# EAGLE design Puncher (EAGLE 7.7.0)
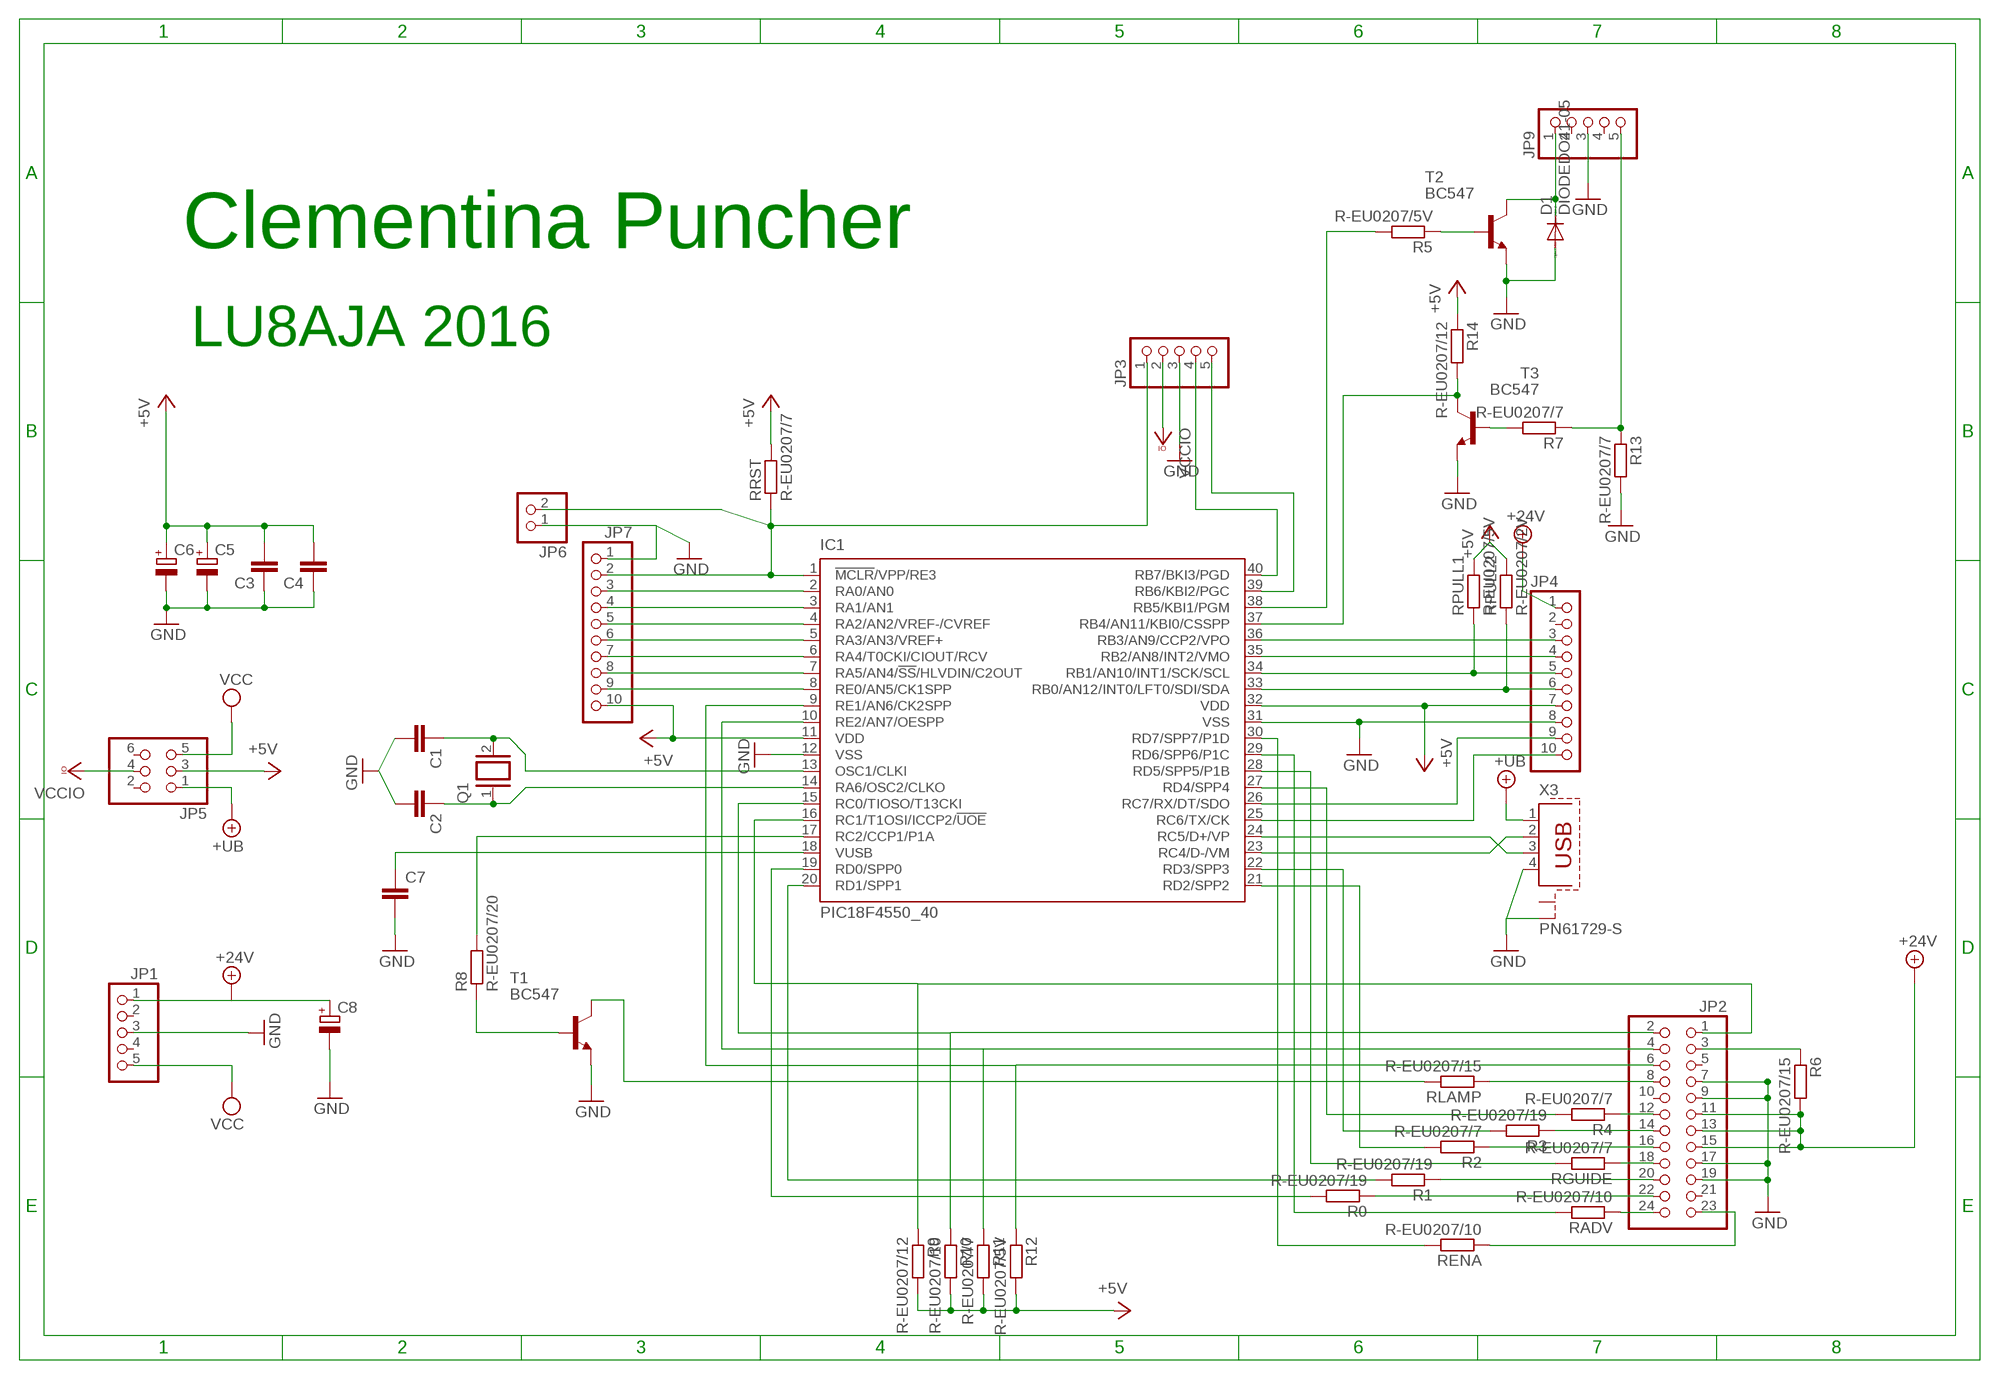
[diagram p0: schematic, sheet 1]

## Parts
C1  C-EU025-025X050  [C025-025X050]
C2  C-EU025-025X050  [C025-025X050]
C3  C-EU050-025X075  [C050-025X075]
C4  C-EU025-030X050  [C025-030X050]
C5  CPOL-EUE5-8.5  [E5-8,5]
C6  CPOL-EUE5-8.5  [E5-8,5]
C7  C-EU050-025X075  [C050-025X075]
C8  CPOL-EUE5-8.5  [E5-8,5]
D1  DIODEDO41-05  [DO41-05]
IC1  PIC18F4550_40  [DIL40]
JP1  PINHD-1X5  [1X05]
JP2  PINHD-2X12  [2X12]
JP3  PINHD-1X5  [1X05]
JP4  PINHD-1X10  [1X10]
JP5  PINHD-2X3  [2X03]
JP6  PINHD-1X2  [1X02]
JP7  PINHD-1X10  [1X10]
JP9  PINHD-1X5  [1X05]
Q1  XTAL/S  [QS]
R0  R-EU0207/19  [0207/19]
R1  R-EU0207/19  [0207/19]
R2  R-EU0207/7  [0207/7]
R3  R-EU0207/19  [0207/19]
R4  R-EU0207/7  [0207/7]
R5  R-EU0207/5V  [0207/5V]
R6  R-EU0207/15  [0207/15]
R7  R-EU0207/7  [0207/7]
R8  R-EU0207/20  [0207/20]
R9  R-EU0207/12  [0207/12]
R10  R-EU0207/10  [0207/10]
R11  R-EU0207/7  [0207/7]
R12  R-EU0207/5V  [0207/5V]
R13  R-EU0207/7  [0207/7]
R14  R-EU0207/12  [0207/12]
RADV  R-EU0207/10  [0207/10]
RENA  R-EU0207/10  [0207/10]
RGUIDE  R-EU0207/7  [0207/7]
RLAMP  R-EU0207/15  [0207/15]
RPULL1  R-EU0207/5V  [0207/5V]
RPULL2  R-EU0207/2V  [0207/2V]
RRST  R-EU0207/7  [0207/7]
T1  BC547  [TO92]
T2  BC547  [TO92]
T3  BC547  [TO92]
X3  PN61729-S  [PN61729-S]

## Nets
+5V: C3.2 C4.2 C5.+ C6.+ IC1.11(VDD) IC1.32(VDD) JP4.7 JP5.3 JP7.10 R9.2 R10.2 R11.2 R12.2 R14.1 RPULL1.2 RPULL2.2 RRST.2
+24V: C8.+ JP1.1 JP2.11 JP2.13 JP2.15 JP4.1 R6.2
+UB: JP5.1 X3.1
GND: C1.2 C2.2 C3.1 C4.1 C5.- C6.- C7.2 C8.- D1.A IC1.12(VSS) IC1.31(VSS) JP1.3 JP2.7 JP2.9 JP2.17 JP2.19 JP3.3 JP4.8 JP6.1 JP7.1 JP9.3 R13.2 T1.1(E) T2.1(E) T3.1(E) X3.4 X3.S2
N$1: JP2.24 RADV.1
N$2: C2.1 IC1.14(RA6/OSC2/CLKO) Q1.1
N$3: IC1.1(!MCLR!/VPP/RE3) JP3.1 JP6.2 JP7.2 RRST.1
N$4: IC1.17(RC2/CCP1/P1A) R8.2
N$5: IC1.16(RC1/T1OSI/ICCP2/!UOE) JP2.1 R9.1
N$6: IC1.15(RC0/TIOSO/T13CKI) JP2.2 R10.1
N$7: IC1.10(RE2/AN7/OESPP) JP2.4 R11.1
N$8: IC1.9(RE1/AN6/CK2SPP) JP2.6 R12.1
N$9: IC1.8(RE0/AN5/CK1SPP) JP7.9
N$10: IC1.7(RA5/AN4/!SS!/HLVDIN/C2OUT) JP7.8
N$11: IC1.6(RA4/T0CKI/CIOUT/RCV) JP7.7
N$12: C1.1 IC1.13(OSC1/CLKI) Q1.2
N$13: IC1.5(RA3/AN3/VREF+) JP7.6
N$14: IC1.4(RA2/AN2/VREF-/CVREF) JP7.5
N$15: C7.1 IC1.18(VUSB)
N$16: JP2.22 R0.1
N$17: IC1.22(RD3/SPP3) R3.2
N$18: JP2.20 R1.1
N$19: JP2.18 RGUIDE.1
N$20: JP2.16 R2.1
N$21: JP2.14 R3.1
N$22: JP2.12 R4.1
N$23: JP2.23 RENA.1
N$24: IC1.30(RD7/SPP7/P1D) RENA.2
N$25: IC1.29(RD6/SPP6/P1C) RADV.2
N$26: IC1.28(RD5/SPP5/P1B) RGUIDE.2
N$27: IC1.24(RC5/D+/VP) X3.3
N$28: IC1.3(RA1/AN1) JP7.4
N$30: IC1.36(RB3/AN9/CCP2/VPO) JP4.3
N$31: IC1.33(RB0/AN12/INT0/LFT0/SDI/SDA) JP4.6 RPULL2.1
N$32: IC1.27(RD4/SPP4) R4.2
N$33: IC1.21(RD2/SPP2) R2.2
N$34: IC1.23(RC4/D-/VM) X3.2
N$35: IC1.20(RD1/SPP1) R1.2
N$36: IC1.19(RD0/SPP0) R0.2
N$37: IC1.25(RC6/TX/CK) JP4.10
N$38: IC1.26(RC7/RX/DT/SDO) JP4.9
N$39: IC1.34(RB1/AN10/INT1/SCK/SCL) JP4.5 RPULL1.1
N$40: IC1.35(RB2/AN8/INT2/VMO) JP4.4
N$41: JP2.8 RLAMP.1
N$42: JP2.3 R6.1
N$43: RLAMP.2 T1.3(C)
N$44: R8.1 T1.2(B)
N$45: IC1.2(RA0/AN0) JP7.3
N$46: IC1.38(RB5/KBI1/PGM) R5.2
N$47: IC1.37(RB4/AN11/KBI0/CSSPP) R14.2 T3.3(C)
N$49: R5.1 T2.2(B)
N$50: D1.C JP9.1 T2.3(C)
N$53: IC1.39(RB6/KBI2/PGC) JP3.5
N$54: IC1.40(RB7/BKI3/PGD) JP3.4
N$55: R7.2 T3.2(B)
N$56: JP9.5 R7.1 R13.1
VCC: JP1.5 JP5.5
VCCIO: JP3.2 JP5.4
Unconnected: JP1.2 JP1.4 JP2.5 JP2.10 JP2.21 JP4.2 JP5.2 JP5.6 JP9.2 JP9.4 X3.S1

## Notes on the sheet
- Clementina Puncher
- LU8AJA 2016

## Library data of the parts
C1-C3 = rcl:C-EU: CAPACITOR, European symbol
C4 C7 = custom:C-EU: CAPACITOR, European symbol
C5 C6 = rcl:CPOL-EU: POLARIZED CAPACITOR, European symbol
C8 = custom:CPOL-EU: POLARIZED CAPACITOR, European symbol
D1 = custom:DIODE: DIODE general purpose rectifier, 1 A
IC1 = microchip:PIC18F4*_40: USB Microcontrollers with nanoWatt Technology High-Performance, Enhanced Flash, 28/40/44-Pin, Source: http://ww1.microchip.com/downloads/en/devicedoc/39632c.pdf; MF: MICROCHIP; MPN: PIC18F4550-I/P; OC_FARNELL: 9321357; OC_NEWARK: 74K8623
JP1 JP3 JP9 = pinhead:PINHD-1X5: PIN HEADER
JP2 = pinhead:PINHD-2X12: PIN HEADER
JP4 JP7 = pinhead:PINHD-1X10: PIN HEADER
JP5 = pinhead:PINHD-2X3: PIN HEADER
JP6 = pinhead:PINHD-1X2: PIN HEADER
Q1 = special:XTAL/S: CRYSTAL
R0 R1-R14 RADV RENA RGUIDE RLAMP RPULL1 RPULL2 RRST = custom:R-EU: RESISTOR, European symbol
T1-T3 = transistor:BC547: NPN TRANSISTOR
X3 = con-berg:PN61729-S: BERG USB connector; OC_FARNELL: unknown; OC_NEWARK: unknown

## Board
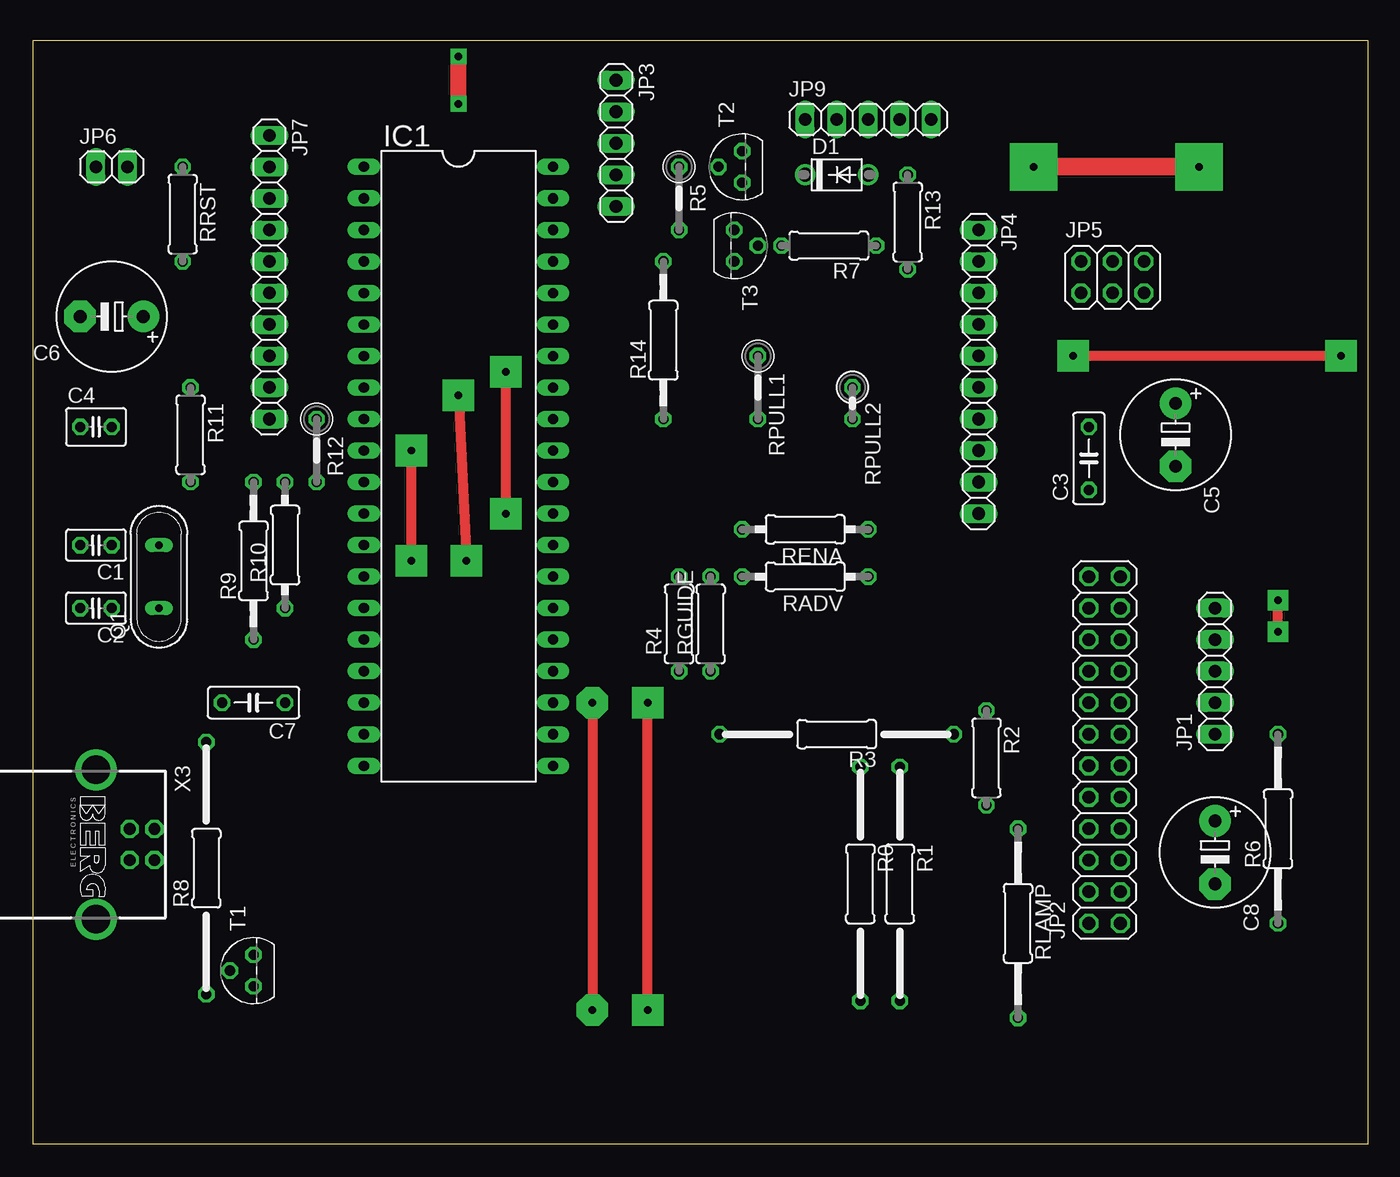
[diagram p1: board, top side]
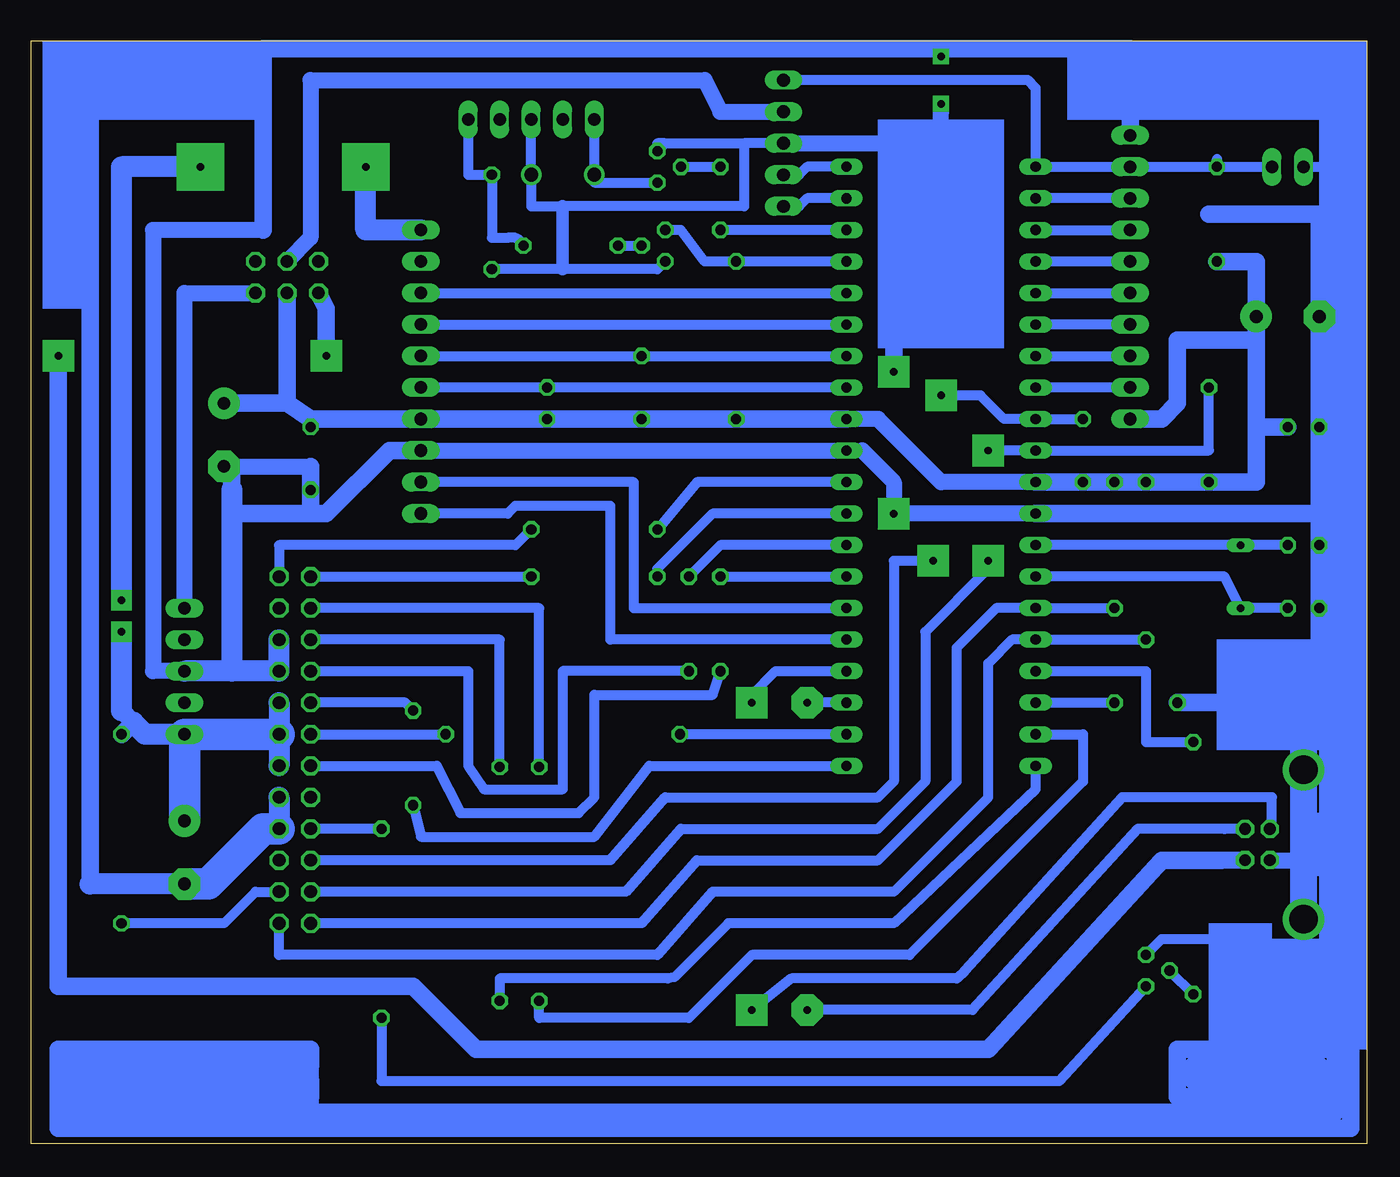
[diagram p2: board, bottom side, seen from below]

Size 107.62 x 88.89 mm. Coordinates in mm from the lower left corner, seen from the top.
Outline: 0,0 107.62,0 107.62,88.89 0,88.89 0,0
Copper layers (1*16): Top 0.035mm / dielectric 1.5mm / Bottom 0.035mm
Design rules "default": minimum track width 10mil, minimum drill 24mil, track to track 8mil, track to pad 8mil, pad to pad 8mil, via to via 8mil, smd to smd 8mil, copper to edge 40mil, drill to drill 8mil, minimum pad ring 10mil, minimum via ring 8mil, stop-mask expansion 4mil, vias tented up to drill 0mil, thermal gap 10mil

### Footprints (pad centres in the part's own frame; a part is rotated, then mirrored left to right if it is on the bottom)
C025-025X050 = drill 0.813 octagon: 1 -1.27,0; 2 1.27,0
C050-025X075 = drill 0.813 octagon: 1 -2.54,0; 2 2.54,0
C025-030X050 = drill 0.813 octagon: 1 -1.27,0; 2 1.27,0
E5-8,5 = drill 1.016 pad 2.54: + -2.54,0 | drill 1.016 pad 2.54 octagon: - 2.54,0
DO41-05 = drill 1.118: A 2.54,0; C -2.54,0
DIL40 = drill 0.813 long: 1 -24.13,-7.62; 2 -21.59,-7.62; 3 -19.05,-7.62; 4 -16.51,-7.62; 5 -13.97,-7.62; 6 -11.43,-7.62; 7 -8.89,-7.62; 8 -6.35,-7.62; 9 -3.81,-7.62; 10 -1.27,-7.62; 11 1.27,-7.62; 12 3.81,-7.62; 13 6.35,-7.62; 14 8.89,-7.62; 15 11.43,-7.62; 16 13.97,-7.62; 17 16.51,-7.62; 18 19.05,-7.62; 19 21.59,-7.62; 20 24.13,-7.62; 21 24.13,7.62; 22 21.59,7.62; 23 19.05,7.62; 24 16.51,7.62; 25 13.97,7.62; 26 11.43,7.62; 27 8.89,7.62; 28 6.35,7.62; 29 3.81,7.62; 30 1.27,7.62; 31 -1.27,7.62; 32 -3.81,7.62; 33 -6.35,7.62; 34 -8.89,7.62; 35 -11.43,7.62; 36 -13.97,7.62; 37 -16.51,7.62; 38 -19.05,7.62; 39 -21.59,7.62; 40 -24.13,7.62
1X05 = drill 1.016 long: 1 -5.08,0; 2 -2.54,0; 3 0,0; 4 2.54,0; 5 5.08,0
2X12 = drill 1.016 octagon: 1 -13.97,-1.27; 2 -13.97,1.27; 3 -11.43,-1.27; 4 -11.43,1.27; 5 -8.89,-1.27; 6 -8.89,1.27; 7 -6.35,-1.27; 8 -6.35,1.27; 9 -3.81,-1.27; 10 -3.81,1.27; 11 -1.27,-1.27; 12 -1.27,1.27; 13 1.27,-1.27; 14 1.27,1.27; 15 3.81,-1.27; 16 3.81,1.27; 17 6.35,-1.27; 18 6.35,1.27; 19 8.89,-1.27; 20 8.89,1.27; 21 11.43,-1.27; 22 11.43,1.27; 23 13.97,-1.27; 24 13.97,1.27
1X10 = drill 1.016 long: 1 -11.43,0; 2 -8.89,0; 3 -6.35,0; 4 -3.81,0; 5 -1.27,0; 6 1.27,0; 7 3.81,0; 8 6.35,0; 9 8.89,0; 10 11.43,0
2X03 = drill 1.016 octagon: 1 -2.54,-1.27; 2 -2.54,1.27; 3 0,-1.27; 4 0,1.27; 5 2.54,-1.27; 6 2.54,1.27
1X02 = drill 1.016 long: 1 -1.27,0; 2 1.27,0
QS = drill 0.61 long: 1 -2.54,0; 2 2.54,0
0207/19 = drill 0.813 octagon: 1 -9.43,0; 2 9.43,0
0207/7 = drill 0.813 octagon: 1 -3.81,0; 2 3.81,0
0207/5V = drill 0.813 octagon: 1 -2.54,0; 2 2.54,0
0207/15 = drill 0.813 octagon: 1 -7.62,0; 2 7.62,0
0207/20 = drill 0.813 octagon: 1 -10.16,0; 2 10.16,0
0207/12 = drill 0.813 octagon: 1 -6.35,0; 2 6.35,0
0207/10 = drill 0.813 octagon: 1 -5.08,0; 2 5.08,0
0207/2V = drill 0.813 octagon: 1 -1.27,0; 2 1.27,0
TO92 = drill 0.813 octagon: 1 1.27,0; 2 0,1.905; 3 -1.27,0
PN61729-S = drill 0.95 octagon: 1 1.25,4.71; 2 -1.25,4.71; 3 -1.25,2.71; 4 1.25,2.71 | drill 2.3 pad 2.9: S1 -6.02,0; S2 6.02,0

### Placement (x,y rotation side)
C1  5.08,48.26 180 top
C2  5.08,43.18 180 top
C3  85.09,55.25 90 top
C4  5.08,57.78 0 top
C5  92.08,57.15 270 top
C6  6.35,66.67 180 top
C7  17.78,35.56 180 top
C8  95.25,23.5 270 top
D1  64.77,78.1 0 top
IC1  34.29,54.61 270 top
JP1  95.25,38.1 90 top
JP2  86.36,31.75 90 top
JP3  46.99,80.64 270 top
JP4  76.2,62.23 270 top
JP5  87,69.85 0 top
JP6  6.35,78.74 0 top
JP7  19.05,69.85 270 top
JP9  67.31,82.55 0 top
Q1  10.16,45.72 90 top
R0  66.67,20.95 270 top
R1  69.85,20.95 270 top
R2  76.84,31.11 270 top
R3  64.77,33.02 180 top
R4  52.07,41.91 90 top
R5  52.07,76.2 270 top
R6  100.33,25.4 90 top
R7  64.14,72.39 180 top
R8  13.97,22.23 90 top
R9  17.78,46.99 90 top
R10  20.32,48.26 90 top
R11  12.7,57.15 270 top
R12  22.86,55.88 270 top
R13  70.48,74.3 270 top
R14  50.8,64.77 90 top
RADV  62.23,45.72 180 top
RENA  62.23,49.53 180 top
RGUIDE  54.61,41.91 90 top
RLAMP  79.38,17.78 270 top
RPULL1  58.42,60.96 270 top
RPULL2  66.04,59.69 270 top
RRST  12.07,74.93 270 top
T1  17.78,13.97 90 top
T2  57.15,78.74 90 top
T3  56.51,72.39 270 top
X3  5.08,24.13 270 top

### Tracks (layer width: path | path; a pad name or v marks a point on that pad's centre or on a via)
+5V
  Bottom 1.016: C3.2 85.09,58.42
  Bottom 1.27: IC1.11 34.29,53.34 39.37,58.42 IC1.32
  Bottom 1.422: IC1.11 R12.2 R10.2 R9.2 R11.2 8.89,53.34 8.89,57.78 | 8.89,64.77 C6.+ 8.89,71.12 RRST.2 | 8.89,64.77 15.24,64.77 15.24,59.69 16.51,58.42 JP7.10 | IC1.32 R14.1 RPULL1.2 RPULL2.2 JP4.7 85.09,58.42 87,59.69 | 87,59.69 C5.+ | JP5.3 87,59.69 | 8.89,57.78 8.89,64.77 | C4.2 8.89,57.78
+24V  (via drill 0.6 pad 1.68, 0.6 pad 3.81)
  Top 0.813: v100.33,41.27 v100.33,43.81
  Top 1.422: v80.65,78.74 v93.98,78.74
  Bottom 1.422: 100.33,34.92 99.38,33.97 R6.2
  Bottom 1.676: JP4.1 80.65,73.66 v80.65,78.74 | v93.98,78.74 100.33,78.74 v100.33,43.81 | JP2.15 JP2.13 JP2.11 | JP1.1 98.42,33.02 99.38,33.97 | 100.33,34.92 v100.33,41.27
  Bottom 2.54: C8.+ JP1.1 JP2.13
+UB  (via drill 0.6 pad 2.54)
  Top 0.813: v105.41,63.5 v83.82,63.5
  Bottom 1.422: X3.1 11.71,22.86 16.51,22.86 30.48,7.62 71.76,7.62 76.84,12.7 105.41,12.7 v105.41,63.5 | v83.82,63.5 83.82,67.31 JP5.1
GND  (via drill 0.6 pad 2.54)
  Top 0.813: v38.1,62.23 v38.1,50.8
  Bottom 0.813: T1.1 16.51,16.51 8.89,16.51 7.62,15.24 5.08,15.24 X3.S2 | JP6.1 3.18,78.74 3.18,75.56 3.81,74.93 | JP3.3 50.16,80.64 | 56.51,80.64 57.15,80.64 T2.1 56.51,80.64 | T3.1 57.15,70.48 64.77,70.48 R13.2 | 56.51,80.64 50.16,80.64 | 50.16,80.64 50.16,75.56 64.77,75.56 67.31,75.56 D1.A JP9.3
  Bottom 1: 64.77,75.56 64.77,70.48
  Bottom 1.016: 40.64,55.88 IC1.31
  Bottom 1.27: 93.98,38.1 JP1.3 97.79,38.1 97.79,73.66 88.9,73.66 | X3.4 7.77,22.86 5.08,22.86 | 5.08,17.78 X3.S2 | JP4.8 IC1.31 | 40.64,55.88 38.1,53.34 v38.1,50.8 IC1.12 | C5.- 91.44,54.61 85.09,54.61 | JP3.3 34.29,80.64 34.29,83.19
  Bottom 1.422: 3.81,50.8 C4.1 C6.- 3.81,74.93 12.7,74.93 | 3.81,50.8 C1.2 C2.2 3.81,38.1 | 5.08,35.56 C7.2 | IC1.12 3.81,50.8 | 3.81,87.63 19.05,88.27 | 19.05,88.27 88.9,88.27 | 88.9,88.27 102.87,87.63 102.87,20.95 | 88.9,88.27 88.9,73.66 | 34.29,81.28 34.29,80.64 34.29,71.12 38.1,66.67 v38.1,62.23 | 85.09,54.61 C3.1 85.09,50.8 | 91.44,52.7 91.44,54.61 | JP7.1 19.05,88.27 | JP4.8 78.74,55.88 83.82,50.8 85.09,50.8 | 85.09,50.8 91.44,50.8
  Bottom 1.676: JP2.19 JP2.17 91.44,38.1 | 91.44,38.1 JP1.3 | C8.- 102.87,20.95 | JP2.9 JP2.7 | 91.44,52.7 91.44,50.8 91.44,38.1
  Bottom 2.184: X3.S2 5.08,22.86 5.08,35.56 3.81,38.1
  Bottom 2.54: C8.- 93.34,20.95 88.9,25.4 JP2.7
N$1
  Bottom 0.813: JP2.24 RADV.1
N$2
  Bottom 0.813: C2.1 Q1.1 11.43,45.72 IC1.14
N$3
  Bottom 0.813: RRST.1 12.07,79.38 | RRST.1 JP6.2 | RRST.1 JP7.2 IC1.1 26.67,85.09 27.3,85.72 JP3.1
N$4
  Bottom 0.813: IC1.17 17.78,38.1 17.78,32.39 R8.2
N$5
  Bottom 0.813: R9.1 IC1.16 28.57,40.64 30.48,38.73 30.48,27.94 38.1,20.32 52.7,20.32 57.15,15.24 87.63,15.24 JP2.1
N$6
  Bottom 0.813: R10.1 IC1.15 29.84,43.18 33.02,40 33.02,29.21 39.37,22.86 53.97,22.86 58.42,17.78 JP2.2
N$7  (via drill 0.6 pad 2.54)
  Top 0.813: v30.48,55.88 v30.48,46.99
  Bottom 0.813: v30.48,55.88 IC1.10 12.7,55.88 R11.1 | JP2.4 59.69,20.32 55.24,25.4 39.37,25.4 35.56,29.21 35.56,41.27 30.48,46.36 v30.48,46.99
N$8  (via drill 0.6 pad 2.54)
  Top 0.813: v34.29,60.33 v34.92,46.99
  Bottom 0.813: v34.29,60.33 31.11,60.33 29.21,58.42 IC1.9 R12.1 | v34.92,46.99 38.1,46.99 38.1,29.21 39.37,27.94 56.51,27.94 60.96,22.86 JP2.6
N$9
  Bottom 0.813: JP7.9 IC1.8
N$10
  Bottom 0.813: IC1.7 JP7.8
N$11
  Bottom 0.813: JP7.7 IC1.6
N$12
  Bottom 0.813: C1.1 Q1.2 IC1.13
N$13
  Bottom 0.813: IC1.5 JP7.6
N$14
  Bottom 0.813: JP7.5 IC1.4
N$15
  Bottom 0.813: IC1.18 C7.1
N$16
  Bottom 0.813: R0.1 66.67,43.18 JP2.22
N$17
  Bottom 0.813: IC1.22 R3.2
N$18
  Bottom 0.813: R1.1 69.85,40.64 JP2.20
N$19
  Bottom 0.813: JP2.18 72.39,38.1 72.39,30.48 71.12,28.57 64.77,28.57 64.77,38.1 RGUIDE.1
N$20
  Bottom 0.813: R2.1 77.47,35.56 JP2.16
N$21
  Bottom 0.813: JP2.14 R3.1
N$22
  Bottom 0.813: JP2.12 74.93,30.48 73.03,26.67 63.5,26.67 62.23,27.94 62.23,36.2 52.7,36.2 R4.1
N$23
  Bottom 0.813: JP2.23 87.63,48.26 68.58,48.26 RENA.1
N$24
  Bottom 0.813: IC1.30 53.97,53.34 RENA.2
N$25
  Bottom 0.813: IC1.29 52.7,50.8 57.15,46.36 RADV.2
N$26
  Bottom 0.813: IC1.28 52.07,48.26 RGUIDE.2
N$27  (via drill 0.6 pad 2.54)
  Top 0.813: v49.53,10.79 v49.53,35.56
  Bottom 0.813: X3.3 7.62,25.55 7.62,27.94 19.68,27.94 32.38,13.97 33.02,13.34 46.35,13.34 v49.53,10.79 | v49.53,35.56 49.53,36.2 47.62,38.1 IC1.24
N$28
  Bottom 0.813: IC1.3 JP7.4
N$29
  Bottom 1.422: 1.27,8.89 1.27,1.27 105.41,1.27 105.41,7.62 85.09,7.62 85.09,6.35 104.14,6.35 104.14,5.08 85.09,5.08 85.09,3.81 104.14,3.81 104.14,2.54 2.54,2.54 2.54,3.81 | 2.54,3.81 2.54,7.62 15.24,7.62 15.24,3.81 2.54,3.81 | 2.54,3.81 3.81,5.08 | 3.81,5.08 3.81,6.35 13.97,6.35 13.97,5.08 3.81,5.08
N$30
  Bottom 0.813: JP4.3 IC1.36
N$31
  Bottom 0.813: IC1.33 RPULL2.1 JP4.6
N$32
  Bottom 0.813: R4.2 IC1.27
N$33
  Bottom 0.813: R2.2 76.2,24.77 62.23,24.77 57.78,30.48 IC1.21
N$34  (via drill 0.6 pad 2.54)
  Top 0.813: v45.08,35.56 v45.08,10.79
  Bottom 0.813: IC1.23 v45.08,35.56 | X3.2 11.45,25.38 13.34,25.4 18.41,25.4 31.75,10.79 v45.08,10.79
N$35
  Bottom 0.813: IC1.20 26.67,28.57 38.1,17.78 51.43,17.78 55.78,13.43 56.32,13.34 69.85,13.34 R1.2
N$36
  Bottom 0.813: IC1.19 22.86,33.02 22.86,29.21 36.83,15.24 49.53,15.24 54.61,10.16 66.67,10.16 R0.2
N$37
  Bottom 0.813: IC1.25 60.96,40.64 60.96,51.44 68.58,51.44 69.22,50.8 JP4.10
N$38
  Bottom 0.813: IC1.26 59.05,43.18 59.05,53.34 JP4.9
N$39
  Bottom 0.813: JP4.5 RPULL1.1 IC1.34
N$40
  Bottom 0.813: JP4.4 IC1.35
N$41
  Bottom 0.813: RLAMP.1 JP2.8
N$42
  Bottom 0.813: R6.1 92.08,17.78 89.54,20.32 JP2.3
N$43
  Bottom 0.813: T1.3 24.77,5.08 79.38,5.08 RLAMP.2
N$44
  Bottom 0.813: T1.2 R8.1
N$45
  Bottom 0.813: JP7.3 IC1.2
N$46
  Bottom 0.813: IC1.38 R5.2
N$47
  Bottom 0.813: IC1.37 R14.2 53.34,71.12 55.24,73.66 T3.3
N$49
  Bottom 0.813: T2.2 R5.1
N$50
  Bottom 0.813: JP9.1 D1.C 62.23,77.47 T2.3
N$51  (via drill 0.6 pad 1.27)
  Top 1.27: v34.29,83.82 v34.29,87.63
N$53
  Bottom 0.813: IC1.39 45.08,76.2 45.72,75.56 JP3.5
N$54
  Bottom 0.813: IC1.40 45.08,78.74 45.72,78.1 JP3.4
N$55
  Bottom 0.813: R7.2 T3.2
N$56
  Bottom 0.813: JP9.5 72.39,78.1 R13.1 70.48,73.03 69.22,73.03 arc90 R7.1
VCC
  Bottom 1.27: JP1.5 95.25,68.58 JP5.5
VCCIO
  Bottom 1.27: JP5.4 85.09,73.03 85.09,85.72 53.34,85.72 52.07,83.19 JP3.2
(copper drawn outside any net)
  shapes: Bottom area x13